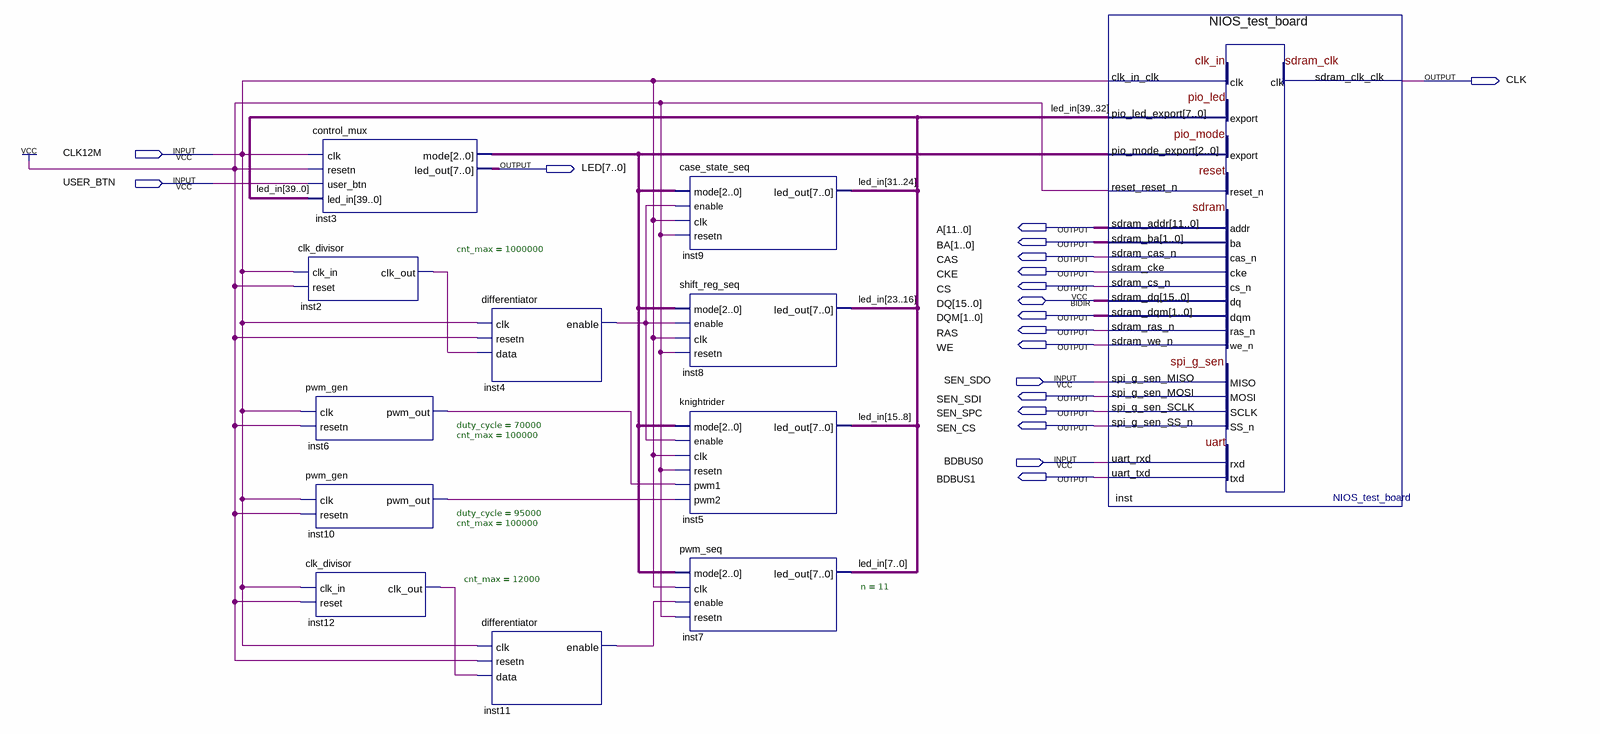
[diagram p0: schematic sheet]
// Quartus schematic test_board.bdf as structural Verilog: 12 symbols, 19 pins
module test_board (
  input  CLK12M,
  input  USER_BTN,
  input  SEN_SDO,
  input  BDBUS0,
  inout  [15:0] DQ,
  output CLK,
  output [7:0] LED,
  output [11:0] A,
  output [1:0] BA,
  output CAS,
  output CKE,
  output CS,
  output [1:0] DQM,
  output RAS,
  output WE,
  output SEN_SDI,
  output SEN_SPC,
  output SEN_CS,
  output BDBUS1
);

  wire inst2_clk_out, inst4_enable, inst6_pwm_out, inst10_pwm_out, inst11_enable, inst12_clk_out;
  wire [2:0] inst3_mode;
  wire [39:0] led_in;

  control_mux inst3 (
    .clk(CLK12M), .resetn(1'b1), .user_btn(USER_BTN), .led_in(led_in), .mode(inst3_mode), .led_out(LED));
  clk_divisor #(.cnt_max(1000000)) inst2 (.clk_in(CLK12M), .reset(1'b1), .clk_out(inst2_clk_out));
  pwm_gen #(.duty_cycle(70000), .cnt_max(100000)) inst6 (.clk(CLK12M), .resetn(1'b1), .pwm_out(inst6_pwm_out));
  pwm_gen #(.duty_cycle(95000), .cnt_max(100000)) inst10 (.clk(CLK12M), .resetn(1'b1), .pwm_out(inst10_pwm_out));
  clk_divisor #(.cnt_max(12000)) inst12 (.clk_in(CLK12M), .reset(1'b1), .clk_out(inst12_clk_out));
  differentiator inst4 (.clk(CLK12M), .resetn(1'b1), .data(inst2_clk_out), .enable(inst4_enable));
  differentiator inst11 (.clk(CLK12M), .resetn(1'b1), .data(inst12_clk_out), .enable(inst11_enable));
  case_state_seq inst9 (.mode(inst3_mode), .enable(inst4_enable), .clk(CLK12M), .resetn(1'b1), .led_out(led_in[31:24]));
  shift_reg_seq inst8 (.mode(inst3_mode), .enable(inst4_enable), .clk(CLK12M), .resetn(1'b1), .led_out(led_in[23:16]));
  knightrider inst5 (
    .mode(inst3_mode), .enable(inst4_enable), .clk(CLK12M), .resetn(1'b1), .pwm1(inst6_pwm_out),
    .pwm2(inst10_pwm_out), .led_out(led_in[15:8]));
  pwm_seq #(.n(11)) inst7 (
    .mode(inst3_mode), .clk(CLK12M), .enable(inst11_enable), .resetn(1'b1), .led_out(led_in[7:0]));
  NIOS_test_board inst (
    .clk_in_clk(CLK12M), .pio_mode_export(inst3_mode), .reset_reset_n(1'b1), .spi_g_sen_MISO(SEN_SDO),
    .uart_rxd(BDBUS0), .pio_led_export(led_in[39:32]), .sdram_addr(A), .sdram_ba(BA), .sdram_cas_n(CAS),
    .sdram_cke(CKE), .sdram_cs_n(CS), .sdram_dqm(DQM), .sdram_ras_n(RAS), .sdram_we_n(WE),
    .sdram_clk_clk(CLK), .spi_g_sen_MOSI(SEN_SDI), .spi_g_sen_SCLK(SEN_SPC), .spi_g_sen_SS_n(SEN_CS),
    .uart_txd(BDBUS1), .sdram_dq(DQ));
endmodule
